# EAGLE design Rev B (EAGLE 6.5.0)

## Sheet 1 of 2
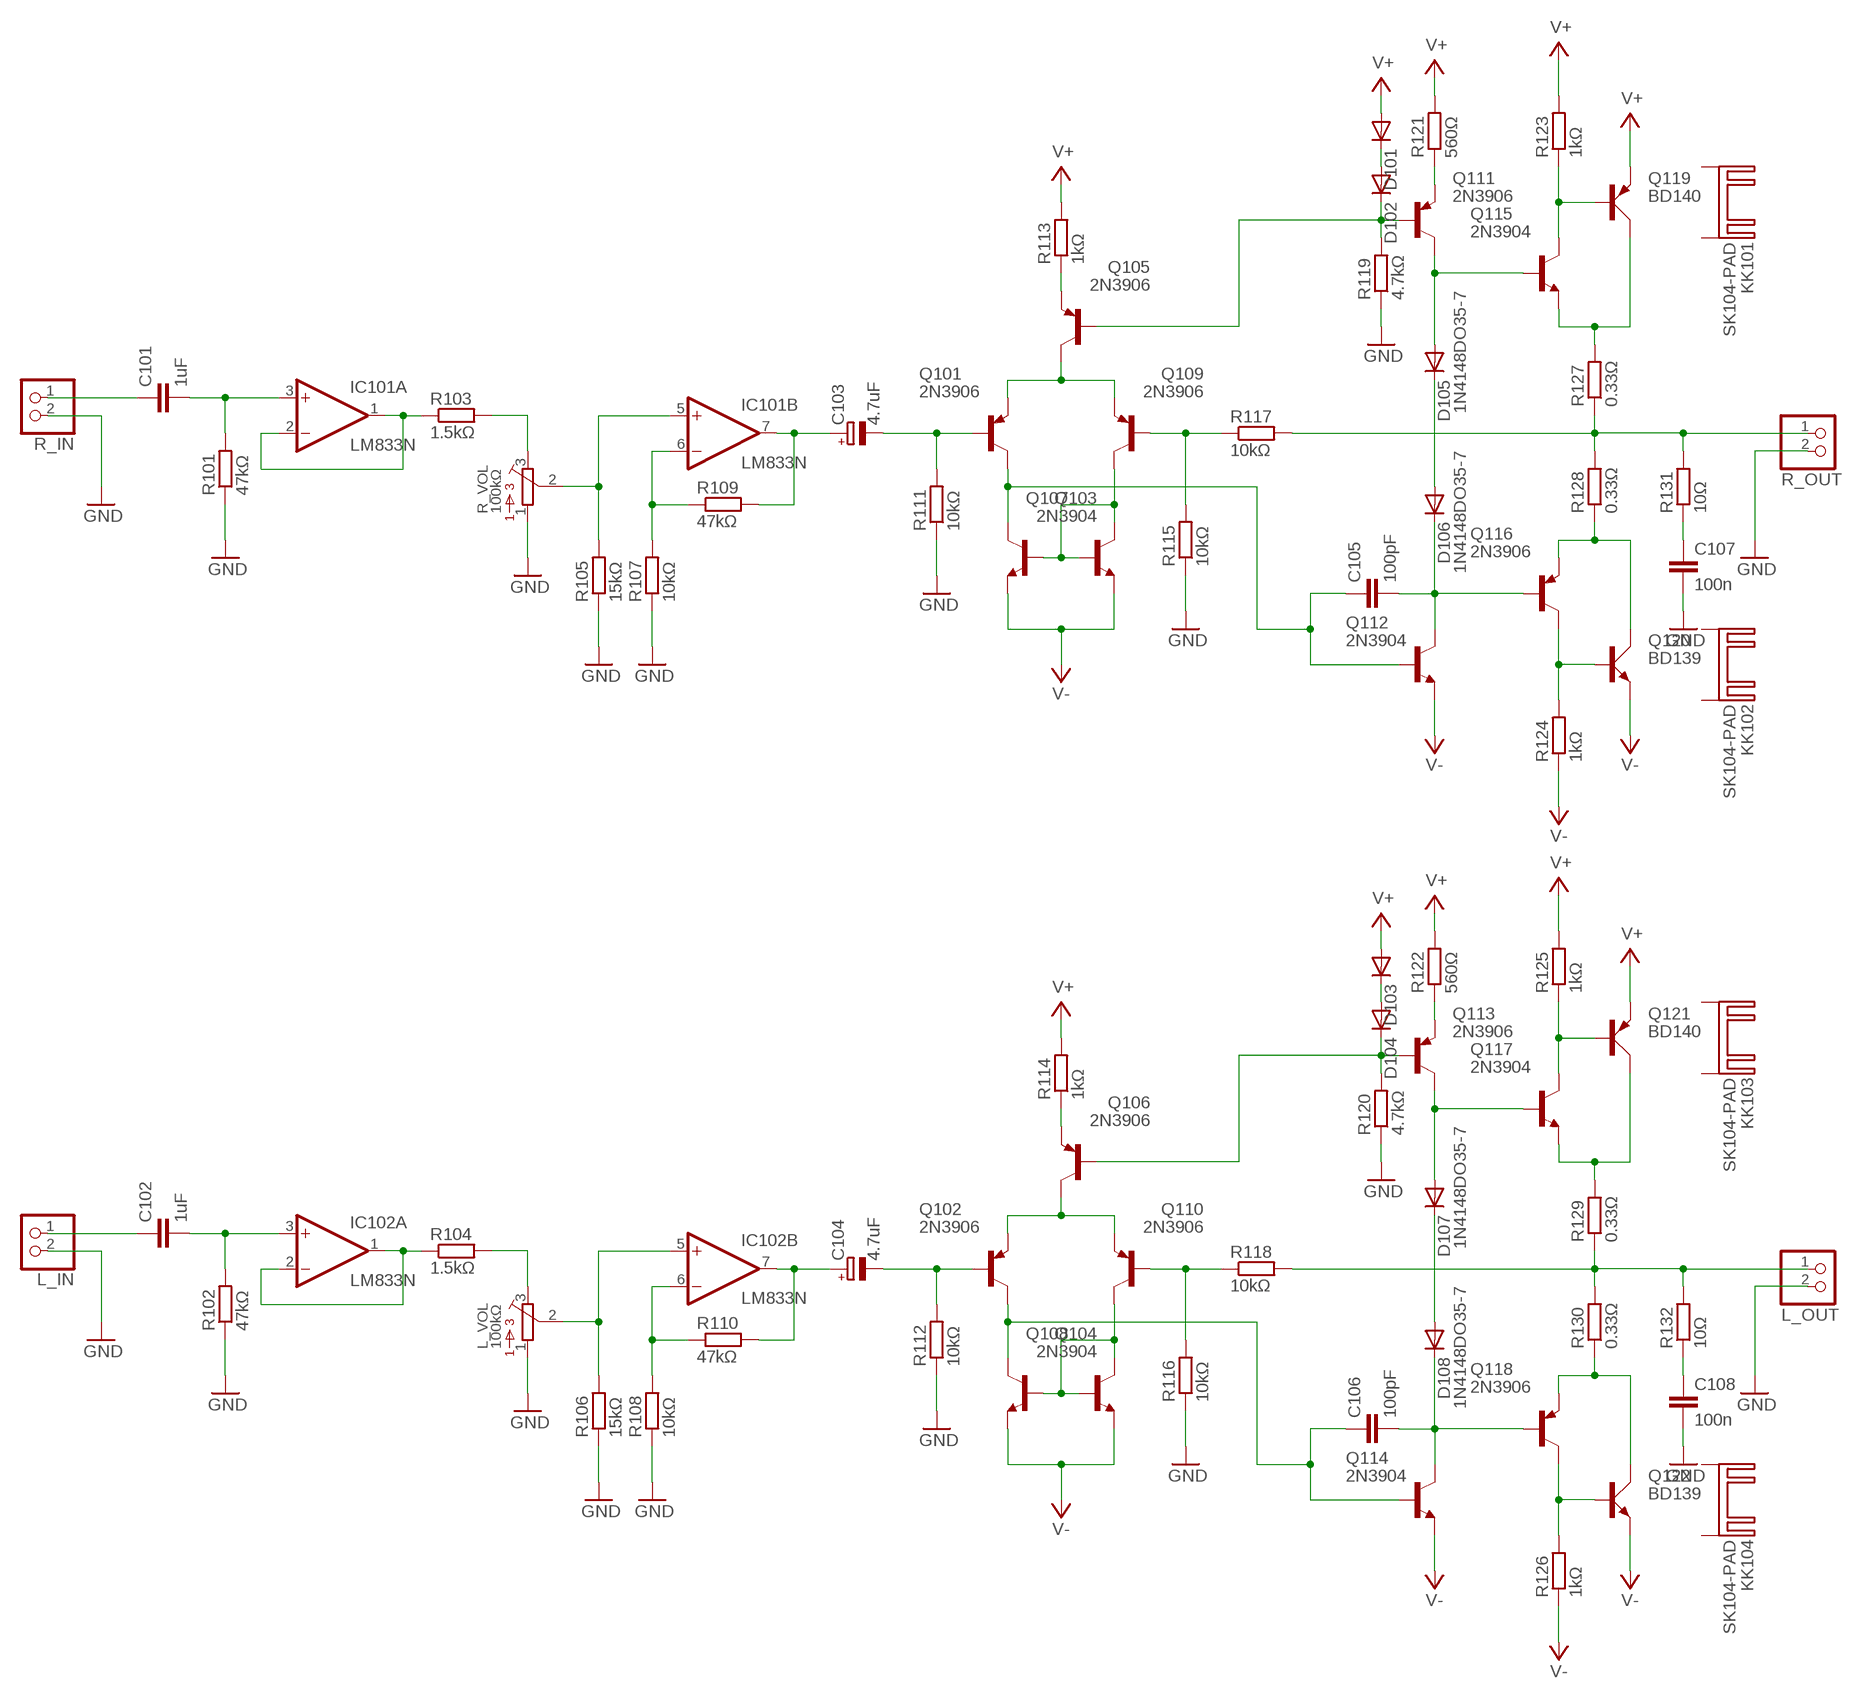
[diagram p0: schematic, sheet 1]

### Parts
C101  1uF  C-EU150-072X183  [C150-072X183]
C102  1uF  C-EU150-072X183  [C150-072X183]
C103  4.7uF  CPOL-EUE2-5  [E2-5]
C104  4.7uF  CPOL-EUE2-5  [E2-5]
C105  100pF  C-EU050-050X075  [C050-050X075]
C106  100pF  C-EU050-050X075  [C050-050X075]
C107  100n  C-EU075-042X103  [C075-042X103]
C108  100n  C-EU075-042X103  [C075-042X103]
D101  1N4148DO35-7  [DO35-7]
D102  1N4148DO35-7  [DO35-7]
D103  1N4148DO35-7  [DO35-7]
D104  1N4148DO35-7  [DO35-7]
D105  1N4148DO35-7  [DO35-7]
D106  1N4148DO35-7  [DO35-7]
D107  1N4148DO35-7  [DO35-7]
D108  1N4148DO35-7  [DO35-7]
IC101  LM833N  [DIL08]
IC102  LM833N  [DIL08]
KK101  SK104-PAD  [SK104-PAD]
KK102  SK104-PAD  [SK104-PAD]
KK103  SK104-PAD  [SK104-PAD]
KK104  SK104-PAD  [SK104-PAD]
L_IN  JST_2PIN-THM  [JST-PH-2-THM]
L_OUT  JST_2PIN-THM  [JST-PH-2-THM]
L_VOL  100kΩ  3362U  [3362U]
Q101  2N3906  [TO92]
Q102  2N3906  [TO92]
Q103  2N3904  [TO92]
Q104  2N3904  [TO92]
Q105  2N3906  [TO92]
Q106  2N3906  [TO92]
Q107  2N3904  [TO92]
Q108  2N3904  [TO92]
Q109  2N3906  [TO92]
Q110  2N3906  [TO92]
Q111  2N3906  [TO92]
Q112  2N3904  [TO92]
Q113  2N3906  [TO92]
Q114  2N3904  [TO92]
Q115  2N3904  [TO92]
Q116  2N3906  [TO92]
Q117  2N3904  [TO92]
Q118  2N3906  [TO92]
Q119  BD140  [TO126AV]
Q120  BD139  [TO126AV]
Q121  BD140  [TO126AV]
Q122  BD139  [TO126AV]
R101  47kΩ  R-EU_0207/10  [0207/10]
R102  47kΩ  R-EU_0207/10  [0207/10]
R103  1.5kΩ  R-EU_0207/10  [0207/10]
R104  1.5kΩ  R-EU_0207/10  [0207/10]
R105  15kΩ  R-EU_0207/10  [0207/10]
R106  15kΩ  R-EU_0207/10  [0207/10]
R107  10kΩ  R-EU_0207/10  [0207/10]
R108  10kΩ  R-EU_0207/10  [0207/10]
R109  47kΩ  R-EU_0207/10  [0207/10]
R110  47kΩ  R-EU_0207/10  [0207/10]
R111  10kΩ  R-EU_0207/10  [0207/10]
R112  10kΩ  R-EU_0207/10  [0207/10]
R113  1kΩ  R-EU_0207/10  [0207/10]
R114  1kΩ  R-EU_0207/10  [0207/10]
R115  10kΩ  R-EU_0207/10  [0207/10]
R116  10kΩ  R-EU_0207/10  [0207/10]
R117  10kΩ  R-EU_0207/10  [0207/10]
R118  10kΩ  R-EU_0207/10  [0207/10]
R119  4.7kΩ  R-EU_0207/10  [0207/10]
R120  4.7kΩ  R-EU_0207/10  [0207/10]
R121  560Ω  R-EU_0207/10  [0207/10]
R122  560Ω  R-EU_0207/10  [0207/10]
R123  1kΩ  R-EU_0207/10  [0207/10]
R124  1kΩ  R-EU_0207/10  [0207/10]
R125  1kΩ  R-EU_0207/10  [0207/10]
R126  1kΩ  R-EU_0207/10  [0207/10]
R127  0.33Ω  R-EU_0309/12  [0309/12]
R128  0.33Ω  R-EU_0309/12  [0309/12]
R129  0.33Ω  R-EU_0309/12  [0309/12]
R130  0.33Ω  R-EU_0309/12  [0309/12]
R131  10Ω  R-EU_0617/5V  [0617V]
R132  10Ω  R-EU_0617/5V  [0617V]
R_IN  JST_2PIN-THM  [JST-PH-2-THM]
R_OUT  JST_2PIN-THM  [JST-PH-2-THM]
R_VOL  100kΩ  3362U  [3362U]

### Nets
GND: C107.2 C108.2 L_IN.2 L_OUT.2 L_VOL.1 R101.1 R102.1 R105.1 R106.1 R107.1 R108.1 R111.1 R112.1 R115.1 R116.1 R119.1 R120.1 R_IN.2 R_OUT.2 R_VOL.1 ; also sheet 2
L_OUT: L_OUT.1 R118.2 R129.1 R130.2 R132.2
N$1: D105.A Q111.1(C) Q115.2(B)
N$2: Q101.3(E) Q105.1(C) Q109.3(E)
N$3: Q103.2(B) Q107.1(C) Q107.2(B) Q109.1(C)
N$4: Q104.2(B) Q108.1(C) Q108.2(B) Q110.1(C)
N$5: C103.- Q101.2(B) R111.2
N$6: C103.+ IC101.7(B:OUT) R109.2
N$7: C101.1 R_IN.1
N$8: C105.1 Q101.1(C) Q103.1(C) Q112.2(B)
N$9: C101.2 IC101.3(A:+IN) R101.2
N$11: IC102.1(A:OUT) IC102.2(A:-IN) R104.1
N$12: IC102.5(B:+IN) L_VOL.2 R106.2
N$13: L_VOL.3 R104.2
N$14: IC102.6(B:-IN) R108.2 R110.1
N$15: C102.1 L_IN.1
N$16: C102.2 IC102.3(A:+IN) R102.2
N$17: Q105.3(E) R113.1
N$18: Q111.3(E) R121.1
N$19: D102.C Q105.2(B) Q111.2(B) R119.2
N$20: D101.C D102.A
N$21: C107.1 R131.1
N$22: C108.1 R132.1
N$23: Q106.3(E) R114.1
N$24: D105.C D106.A
N$25: C104.- Q102.2(B) R112.2
N$26: Q115.1(C) Q119.B R123.1
N$27: Q116.1(C) Q120.B R124.2
N$28: Q116.3(E) Q120.C R128.1
N$29: Q115.3(E) Q119.C R127.2
N$30: C104.+ IC102.7(B:OUT) R110.2
N$31: C105.2 D106.C Q112.1(C) Q116.2(B)
N$32: Q109.2(B) R115.2 R117.1
N$33: Q102.3(E) Q106.1(C) Q110.3(E)
N$34: C106.1 Q102.1(C) Q104.1(C) Q114.2(B)
N$35: D107.C D108.A
N$36: D107.A Q113.1(C) Q117.2(B)
N$37: Q117.1(C) Q121.B R125.1
N$38: Q117.3(E) Q121.C R129.2
N$39: Q118.1(C) Q122.B R126.2
N$40: Q118.3(E) Q122.C R130.1
N$41: C106.2 D108.C Q114.1(C) Q118.2(B)
N$42: Q110.2(B) R116.2 R118.1
N$43: Q113.3(E) R122.1
N$44: D104.C Q106.2(B) Q113.2(B) R120.2
N$45: D103.C D104.A
N$56: IC101.1(A:OUT) IC101.2(A:-IN) R103.1
N$58: IC101.5(B:+IN) R105.2 R_VOL.2
N$60: R103.2 R_VOL.3
N$62: IC101.6(B:-IN) R107.2 R109.1
R_OUT: R117.2 R127.1 R128.2 R131.2 R_OUT.1
V+: D101.A D103.A Q119.E Q121.E R113.2 R114.2 R121.2 R122.2 R123.2 R125.2 ; also sheet 2
V-: Q103.3(E) Q104.3(E) Q107.3(E) Q108.3(E) Q112.3(E) Q114.3(E) Q120.E Q122.E R124.1 R126.1 ; also sheet 2
Unconnected: KK101.K1(K) KK101.K2(K) KK102.K1(K) KK102.K2(K) KK103.K1(K) KK103.K2(K) KK104.K1(K) KK104.K2(K)

## Sheet 2 of 2
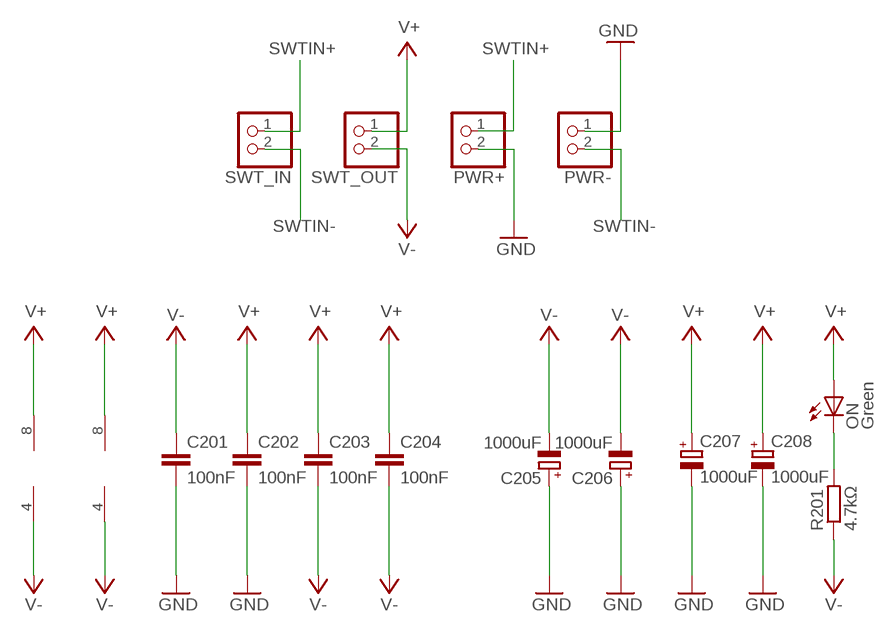
[diagram p1: schematic, sheet 2]

### Parts
C201  100nF  C-EU025-025X050  [C025-025X050]
C202  100nF  C-EU025-025X050  [C025-025X050]
C203  100nF  C-EU025-025X050  [C025-025X050]
C204  100nF  C-EU025-025X050  [C025-025X050]
C205  1000uF  CPOL-EUE5-10.5  [E5-10,5]
C206  1000uF  CPOL-EUE5-10.5  [E5-10,5]
C207  1000uF  CPOL-EUE5-10.5  [E5-10,5]
C208  1000uF  CPOL-EUE5-10.5  [E5-10,5]
ON  Green  LED5MM  [LED5MM]
PWR+  JST_2PIN-THM  [JST-PH-2-THM]
PWR-  JST_2PIN-THM  [JST-PH-2-THM]
R201  4.7kΩ  R-EU_0207/10  [0207/10]
SWT_IN  JST_2PIN-THM  [JST-PH-2-THM]
SWT_OUT  JST_2PIN-THM  [JST-PH-2-THM]

### Nets
GND: C201.2 C202.2 C205.+ C206.+ C207.- C208.- PWR+.2 PWR-.1 ; also sheet 1
N$10: ON.K(C) R201.2
SWTIN+: PWR+.1 SWT_IN.1
SWTIN-: PWR-.2 SWT_IN.2
V+: C202.1 C203.1 C204.1 C207.+ C208.+ IC101.8(P:V+) IC102.8(P:V+) ON.A SWT_OUT.1 ; also sheet 1
V-: C201.1 C203.2 C204.2 C205.- C206.- IC101.4(P:V-) IC102.4(P:V-) R201.1 SWT_OUT.2 ; also sheet 1

## Library data of the parts
C101 C102 C105-C108 C201-C204 = rcl:C-EU: CAPACITOR, European symbol
C103 C104 C205-C208 = rcl:CPOL-EU: POLARIZED CAPACITOR, European symbol
D101-D108 = diode:1N4148: DIODE high speed (Philips)
IC101 IC102 = linear:LM833: OP AMP
KK101-KK104 = heatsink:SK104-PAD: HEATSINK manufacturer Fischer/distributor Buerklin
L_IN L_OUT PWR+ PWR- R_IN R_OUT SWT_IN SWT_OUT = adafruit:JST_2PIN: JST 2-Pin Connectors of various flavors SMT-RA (S2B-PH-SM4) 4UConnector #17311 SMT (B2B-PH-SM4) THM-RA (S2B-PH) THM (B2B-PH)
L_VOL R_VOL = bourns:3362: 3362 Series 1/4" Square Trimmer
ON = led:LED: LED OSRAM: - CHIPLED LG R971, LG N971, LY N971, LG Q971, LY Q971, LO R971, LY R971 LH N974, LH R974 LS Q976, LO Q976, LY Q976 LO Q996 - Hyper CHIPLED LW Q18S LB Q993, LB Q99A, LB R99A - SideLED LS A670, LO A670, LY A670, LG A670, LP A670 LB A673, LV A673, LT A673, LW A673 LH A674 LY A675 LS A676, LA A676, LO A676, LY A676, LW A676 LS A679, LY A679, LG A679 - Hyper Micro SIDELED® LS Y876, LA Y876, LO Y876, LY Y876 LT Y87S - SmartLED LW L88C, LW L88S LB L89C, LB L89S, LG L890 LS L89K, LO L89K, LY L89K LS L896, LA L896, LO L896, LY L896 - TOPLED LS T670, LO T670, LY T670, LG T670, LP T670 LSG T670, LSP T670, LSY T670, LOP T670, LYG T670 LG T671, LOG T671, LSG T671 LB T673, LV T673, LT T673, LW T673 LH T674 LS T676, LA T676, LO T676, LY T676, LB T676, LH T676, LSB T676, LW T676 LB T67C, LV T67C, LT T67C, LS T67K, LO T67K, LY T67K, LW E67C LS E67B, LA E67B, LO E67B, LY E67B, LB E67C, LV E67C, LT E67C LW T67C LS T679, LY T679, LG T679 LS T770, LO T770, LY T770, LG T770, LP T770 LB T773, LV T773, LT T773, LW T773 LH T774 LS E675, LA E675, LY E675, LS T675 LS T776, LA T776, LO T776, LY T776, LB T776 LHGB T686 LT T68C, LB T68C - Hyper Mini TOPLED® LB M676 - Mini TOPLED Santana® LG M470 LS M47K, LO M47K, LY M47K Source: http://www.osram.convergy.de LUXEON: - LUMILED® LXK2-PW12-R00, LXK2-PW12-S00, LXK2-PW14-U00, LXK2-PW14-V00 LXK2-PM12-R00, LXK2-PM12-S00, LXK2-PM14-U00 LXK2-PE12-Q00, LXK2-PE12-R00, LXK2-PE12-S00, LXK2-PE14-T00, LXK2-PE14-U00 LXK2-PB12-K00, LXK2-PB12-L00, LXK2-PB12-M00, LXK2-PB14-N00, LXK2-PB14-P00, LXK2-PB14-Q00 LXK2-PR12-L00, LXK2-PR12-M00, LXK2-PR14-Q00, LXK2-PR14-R00 LXK2-PD12-Q00, LXK2-PD12-R00, LXK2-PD12-S00 LXK2-PH12-R00, LXK2-PH12-S00 LXK2-PL12-P00, LXK2-PL12-Q00, LXK2-PL12-R00 Source: www.luxeon.com KINGBRIGHT: KA-3528ASYC Source: www.kingbright.com
Q101 Q102 Q105 Q106 Q109-Q111 Q113 Q116 Q118 = transistor-pnp:2N3906: PNP Transistor
Q103 Q104 Q107 Q108 Q112 Q114 Q115 Q117 = transistor:2N3904: NPN TRANSISTOR
Q119 Q121 = transistor-power:BD140: PNP TRANSISTOR
Q120 Q122 = transistor-power:BD139: NPN TRANSISTOR
R101-R132 R201 = rcl:R-EU_: RESISTOR, European symbol

## Board
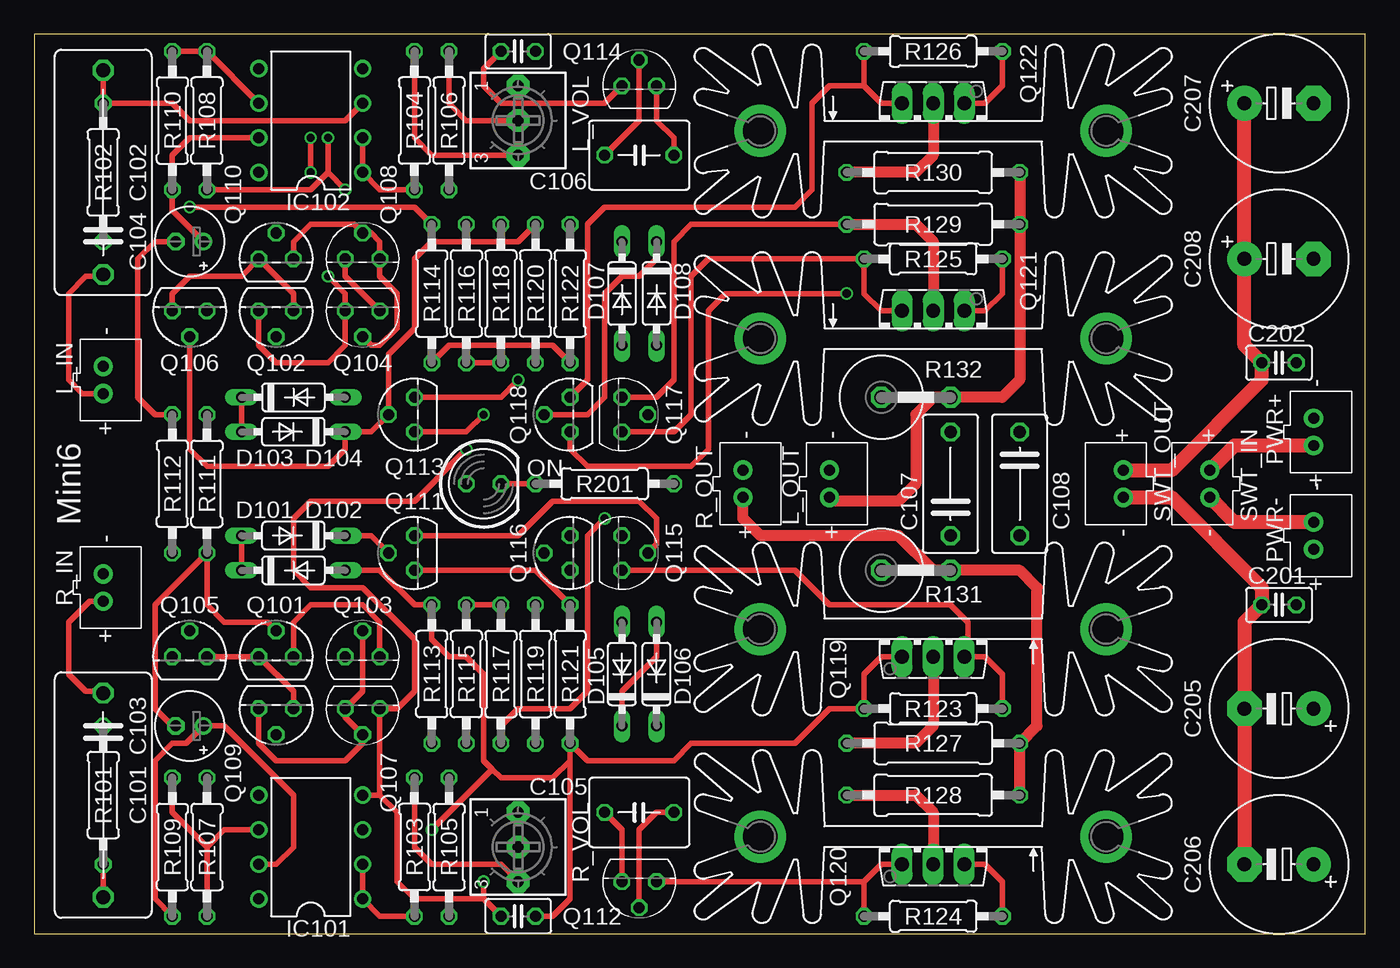
[diagram p2: board, top side]
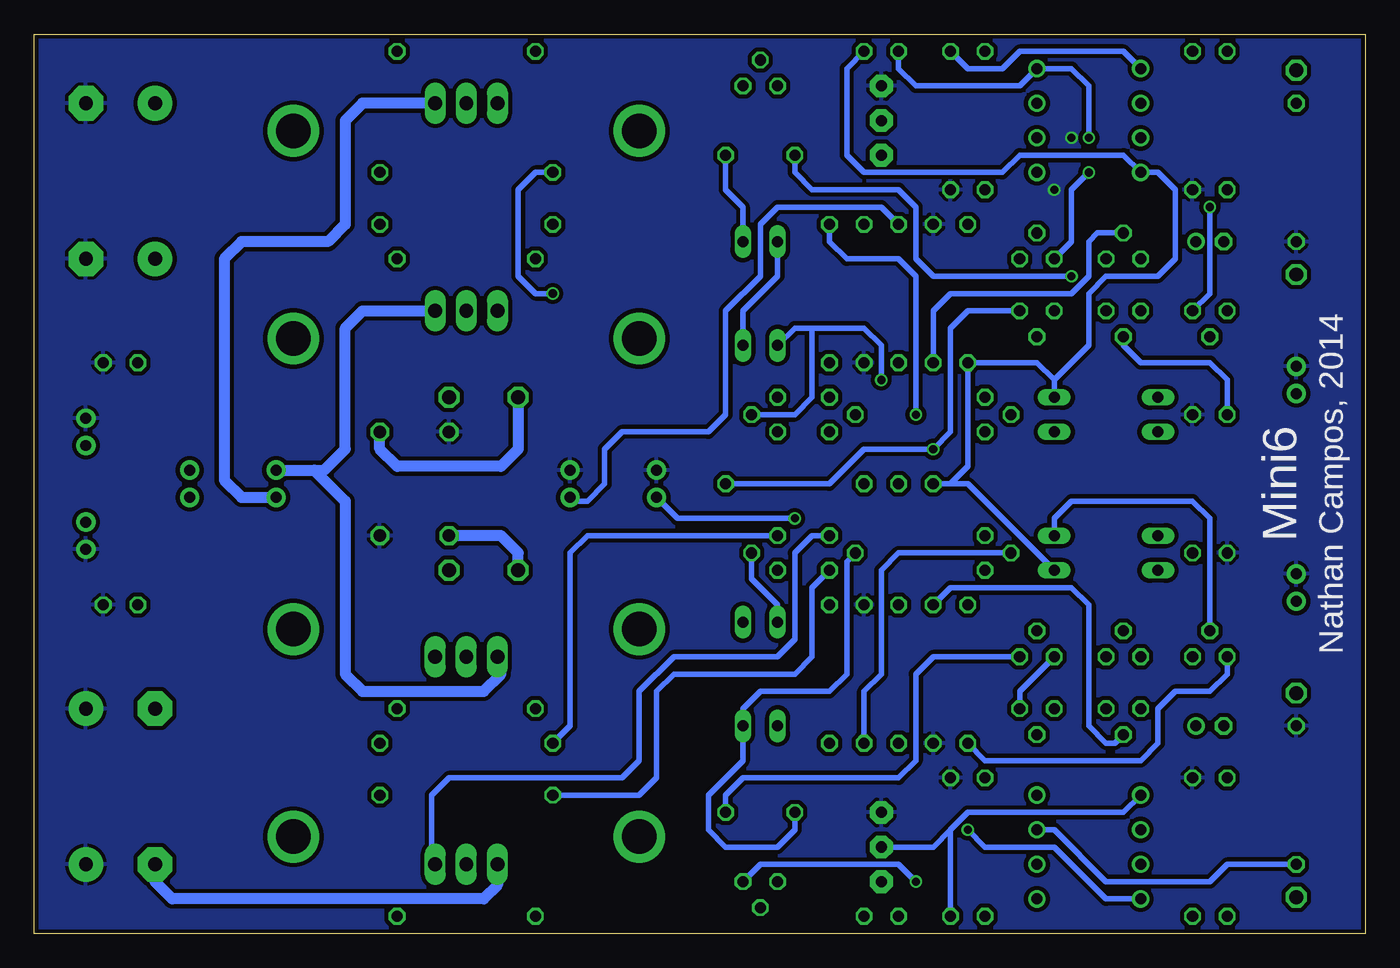
[diagram p3: board, bottom side, seen from below]

Size 97.79 x 66.04 mm. Coordinates in mm from the lower left corner, seen from the top.
Outline: 0,0 97.77,0 97.79,66.04 0,66.04 0,0
Copper layers (1*2*15*16): Top 0.035mm / dielectric 0.2mm / Route2 0.0175mm / dielectric 1.1mm / Route15 0.0175mm / dielectric 0.2mm / Bottom 0.035mm
Design rules "SeeedStudio_DRU_no_angle_20130527": minimum track width 6mil, minimum drill 12mil, track to track 6mil, track to pad 6mil, pad to pad 6mil, via to via 6mil, smd to smd 0mil, copper to edge 10mil, drill to drill 10mil, minimum pad ring 6mil, minimum via ring 6mil, stop-mask expansion 2mil, vias tented up to drill 25mil, thermal gap 10mil

### Footprints (pad centres in the part's own frame; a part is rotated, then mirrored left to right if it is on the bottom)
C150-072X183 = drill 1.016 octagon: 1 -7.493,0; 2 7.493,0
E2-5 = drill 0.813 pad 1.27: + -1.016,0 | drill 0.813 pad 1.27 octagon: - 1.016,0
C050-050X075 = drill 0.813 octagon: 1 -2.54,0; 2 2.54,0
C075-042X103 = drill 0.914 octagon: 1 -3.81,0; 2 3.81,0
C025-025X050 = drill 0.813 octagon: 1 -1.27,0; 2 1.27,0
E5-10,5 = drill 1.016 pad 2.54: + -2.54,0 | drill 1.016 pad 2.54 octagon: - 2.54,0
DO35-7 = drill 0.813 long: A 3.81,0; C -3.81,0
DIL08 = drill 0.813 pad 1.27: 1 -3.81,-3.81; 2 -1.27,-3.81; 3 1.27,-3.81; 4 3.81,-3.81; 5 3.81,3.81; 6 1.27,3.81; 7 -1.27,3.81; 8 -3.81,3.81
SK104-PAD = drill 2.54 pad 3.81: K1 -12.7,-0.762; K2 12.7,-0.762
JST-PH-2-THM = drill 0.8 pad 1.422: 1 1,0; 2 -1,0
3362U = drill 0.813 pad 1.676 octagon: 1 -2.54,0; 2 0,0; 3 2.54,0
LED5MM = drill 0.813 octagon: A -1.27,0; K 1.27,0
TO92 = drill 0.813 octagon: 1 1.27,0; 2 0,1.905; 3 -1.27,0
TO126AV = drill 1.016 long: B 2.286,-1.27; C 0,-1.27; E -2.286,-1.27
0207/10 = drill 0.813 octagon: 1 -5.08,0; 2 5.08,0
0309/12 = drill 0.813 octagon: 1 -6.35,0; 2 6.35,0
0617V = drill 1.016 octagon: 1 -2.54,0; 2 2.54,0

### Placement (x,y rotation side)
C101  5.08,10.16 270 top
C102  5.08,55.88 90 top
C103  11.43,15.24 180 top
C104  11.43,50.8 180 top
C105  44.45,8.89 180 top
C106  44.45,57.15 0 top
C107  67.31,33.02 90 top
C108  72.39,33.02 270 top
C201  91.44,24.13 0 top
C202  91.44,41.91 0 top
C203  35.56,1.27 180 top
C204  35.56,64.77 180 top
C205  91.44,16.51 180 top
C206  91.44,5.08 180 top
C207  91.44,60.96 0 top
C208  91.44,49.53 0 top
D101  19.05,26.67 0 top
D102  19.05,29.21 180 top
D103  19.05,39.37 0 top
D104  19.05,36.83 180 top
D105  43.18,19.05 90 top
D106  45.72,19.05 90 top
D107  43.18,46.99 270 top
D108  45.72,46.99 270 top
IC101  20.32,6.35 90 top
IC102  20.32,59.69 90 top
KK101  66.04,21.59 180 top
KK102  66.04,44.45 0 top
KK103  66.04,6.35 180 top
KK104  66.04,59.69 0 top
L_IN  5.08,40.64 270 top
L_OUT  58.42,33.02 270 top
L_VOL  35.56,59.69 270 top
ON  33.02,33.02 0 top
PWR+  93.98,36.83 270 top
PWR-  93.98,29.21 270 top
Q101  17.78,20.32 0 top
Q102  17.78,45.72 180 top
Q103  24.13,20.32 0 top
Q104  24.13,45.72 180 top
Q105  11.43,20.32 0 top
Q106  11.43,45.72 180 top
Q107  24.13,16.51 180 top
Q108  24.13,49.53 0 top
Q109  17.78,16.51 180 top
Q110  17.78,49.53 0 top
Q111  27.94,27.94 90 top
Q112  44.45,3.81 180 top
Q113  27.94,38.1 90 top
Q114  44.45,62.23 0 top
Q115  43.18,27.94 270 top
Q116  39.37,27.94 90 top
Q117  43.18,38.1 270 top
Q118  39.37,38.1 90 top
Q119  66.04,21.59 0 top
Q120  66.04,6.35 0 top
Q121  66.04,44.45 180 top
Q122  66.04,59.69 180 top
R101  5.08,10.16 270 top
R102  5.08,55.88 90 top
R103  27.94,6.35 90 top
R104  27.94,59.69 90 top
R105  30.48,6.35 270 top
R106  30.48,59.69 90 top
R107  12.7,6.35 270 top
R108  12.7,59.69 90 top
R109  10.16,6.35 270 top
R110  10.16,59.69 270 top
R111  12.7,33.02 270 top
R112  10.16,33.02 90 top
R113  29.21,19.05 90 top
R114  29.21,46.99 270 top
R115  31.75,19.05 90 top
R116  31.75,46.99 270 top
R117  34.29,19.05 270 top
R118  34.29,46.99 90 top
R119  36.83,19.05 270 top
R120  36.83,46.99 90 top
R121  39.37,19.05 270 top
R122  39.37,46.99 270 top
R123  66.04,16.51 180 top
R124  66.04,1.27 0 top
R125  66.04,49.53 0 top
R126  66.04,64.77 180 top
R127  66.04,13.97 180 top
R128  66.04,10.16 0 top
R129  66.04,52.07 180 top
R130  66.04,55.88 0 top
R131  64.77,26.67 0 top
R132  64.77,39.37 0 top
R201  41.91,33.02 180 top
R_IN  5.08,25.4 270 top
R_OUT  52.07,33.02 270 top
R_VOL  35.56,6.35 270 top
SWT_IN  86.36,33.02 90 top
SWT_OUT  80.01,33.02 90 top

### Tracks (layer width: path | path; a pad name or v marks a point on that pad's centre or on a via)
GND  (via drill 0.6)
  Top 0.406: 21.59,55.88 v22.86,54.61 | R108.1 20.32,54.61 21.59,55.88 | v21.59,58.42 21.59,55.88
  pour Bottom (isolate 0.305): 0,66.04 0,0 97.79,0 97.79,66.04
L_OUT
  Top 0.813: R130.2 R129.1 72.39,40.64 71.12,39.37 R132.2 66.04,39.37 64.77,38.1 64.77,33.02 63.5,31.75 58.69,31.75 L_OUT.1
  Bottom 0.406: R118.2 35.56,53.34 43.18,53.34 44.45,52.07 44.45,48.26 46.99,45.72 46.99,38.1 48.26,36.83 54.61,36.83 55.88,35.56 55.88,33.02 57.15,31.75 58.15,31.75 L_OUT.1
N$1
  Top 0.406: Q111.1 35.56,29.21 38.1,31.75 44.45,31.75 45.72,30.48 45.72,28.57 Q115.2
  Bottom 0.406: Q115.2 45.09,26.04 43.18,24.13 D105.A
N$2
  Top 0.406: Q105.1 Q101.3 19.05,17.78 Q109.3
N$3
  Top 0.406: Q103.2 24.13,17.78 Q107.1 22.86,15.88 Q107.2 24.13,13.97 22.86,12.7 17.78,12.7 16.51,13.97 Q109.1
N$4
  Top 0.406: Q104.2 24.77,43.18 25.4,43.18 26.67,44.45 26.67,46.99 25.4,48.26 Q108.1 25.4,50.8 24.77,51.44 Q108.2 23.5,52.07 20.32,52.07 19.05,50.8 Q110.1
N$5
  Top 0.406: C103.- 10.16,15.24 8.89,16.51 8.89,24.13 R111.2 12.7,24.13 13.97,22.86 17.14,22.86 Q101.2
N$6
  Top 0.406: R109.2 8.89,2.54 8.89,12.7 10.16,13.97 11.18,13.97 C103.+ 13.97,15.24 19.05,10.16 19.05,6.35 17.78,5.08 IC101.7
N$7
  Top 0.406: R_IN.1 4.08,24.4 2.54,22.86 2.54,19.05 3.81,17.78 4.95,17.78 C101.1
N$8
  Top 0.406: Q112.2 44.45,7.62 45.72,8.89 C105.1 | Q103.1 25.4,22.86 24.13,24.13 20.32,24.13 19.05,22.86 Q101.1
  Bottom 0.406: Q103.1 31.75,20.32 33.02,19.05 33.02,12.7 34.29,11.43 45.72,11.43 46.99,10.16 C105.1
N$9
  Top 0.406: R101.2 C101.2
  Bottom 0.406: R101.2 10.16,5.08 11.43,3.81 19.05,3.81 22.86,7.62 IC101.3
N$10
  Top 0.406: ON.K R201.2
N$11
  Top 0.406: R104.1 25.4,54.61 IC102.1 IC102.2
N$12
  Top 0.406: R106.2 30.48,60.96 31.75,59.69 L_VOL.2
  Bottom 0.406: IC102.5 17.78,64.77 25.4,64.77 26.67,63.5 29.21,63.5 R106.2
N$13
  Top 0.406: R104.2 27.94,58.42 29.21,57.15 L_VOL.3
N$14
  Top 0.406: R110.1 R108.2 IC102.6
N$15
  Top 0.406: L_IN.1 3.54,39.64 2.54,40.64 2.54,46.99 3.81,48.26 4.95,48.26 C102.1
N$16
  Top 0.406: C102.2 R102.2 10.16,60.96 11.43,59.69 22.86,59.69 IC102.3
N$17
  Bottom 0.406: Q105.3 10.16,19.05 11.43,17.78 13.97,17.78 15.24,16.51 15.24,13.97 16.51,12.7 27.94,12.7 R113.1
N$18
  Top 0.406: Q111.3 36.83,26.67 R121.1
N$19
  Top 0.406: D102.C 24.77,29.21 Q111.2
  Bottom 0.406: R119.2 36.83,17.78 35.56,19.05 35.56,26.67 34.29,27.94 Q111.2 | Q105.2 11.43,30.48 12.7,31.75 21.59,31.75 22.86,30.48 D102.C
N$20
  Top 0.406: D102.A D101.C
N$21
  Bottom 0.813: R131.1 62.23,27.94 63.5,29.21 C107.1
N$22
  Bottom 0.813: R132.1 62.23,35.56 63.5,34.29 71.12,34.29 72.39,35.56 C108.1
N$23  (via drill 0.6)
  Top 0.406: R114.1 27.94,53.34 v11.43,53.34
  Bottom 0.406: v11.43,53.34 11.43,46.99 Q106.3
N$24
  Top 0.406: D106.A 45.72,20.32 43.18,17.78 D105.C
N$25
  Top 0.406: C104.- 8.89,50.8 7.62,49.53 7.62,39.37 8.89,38.1 R112.2
  Bottom 0.406: R112.2 10.16,40.64 11.43,41.91 16.51,41.91 17.78,43.18 Q102.2
N$26
  Top 0.406: R123.1 71.12,19.05 69.85,20.32 Q119.B 68.58,20.57 68.58,22.86 67.31,24.13 58.42,24.13 55.88,26.67 Q115.1
N$27
  Top 0.406: Q120.B 69.85,5.08 71.12,3.81 R124.2
  Bottom 0.406: Q116.1 40.64,29.21 41.91,27.94 41.91,21.59 43.18,20.32 50.8,20.32 53.34,17.78 53.34,12.7 54.61,11.43 67.31,11.43 68.58,10.16 68.58,5.33 Q120.B
N$28
  Top 0.813: R128.1 64.77,10.16 66.04,8.89 Q120.C
  Bottom 0.406: Q116.3 40.64,25.4 40.64,20.32 41.91,19.05 50.8,19.05 52.07,17.78 52.07,11.43 53.34,10.16 R128.1
N$29
  Top 0.813: Q119.C 66.04,15.24 64.77,13.97 R127.2
  Bottom 0.406: Q115.3 57.15,29.21 58.42,27.94 58.42,15.24 R127.2
N$30
  Top 0.406: IC102.7 11.43,58.42 10.16,57.15 R110.2 10.16,53.09 C104.+
N$31
  Top 0.406: C105.2 43.18,7.62 Q112.1
  Bottom 0.406: C105.2 41.91,7.62 43.18,6.35 46.99,6.35 48.26,7.62 48.26,10.16 45.72,12.7 D106.C 45.72,16.51 44.45,17.78 39.37,17.78 38.1,19.05 38.1,27.3 Q116.2
N$32
  Top 0.406: R117.1 R115.2
  Bottom 0.406: R115.2 30.48,25.4 21.59,25.4 20.32,24.13 20.32,15.24 19.05,13.97 18.41,13.97 Q109.2
N$33
  Top 0.406: Q106.1 10.16,46.99 11.43,48.26 15.24,48.26 Q110.3 19.05,46.99 Q102.3
N$34  (via drill 0.6)
  Top 0.406: Q114.2 44.45,59.69 C106.1 | Q102.1 16.51,43.18 17.78,41.91 21.59,41.91 22.86,43.18 Q104.1 22.86,46.99 v21.59,48.26
  Bottom 0.406: v21.59,48.26 31.75,48.26 33.02,49.53 33.02,53.34 34.29,54.61 40.64,54.61 41.91,55.88 C106.1
N$35
  Bottom 0.406: D107.C 43.18,48.26 45.72,45.72 D108.A
N$36  (via drill 0.6)
  Top 0.406: Q113.1 34.29,39.37 v35.56,40.64
  Bottom 0.406: v35.56,40.64 35.56,43.18 36.83,44.45 40.64,44.45 | 40.64,44.45 41.91,44.45 D107.A | Q117.2 41.91,38.1 40.64,39.37 40.64,44.45
N$37
  Top 0.406: Q121.B 62.23,45.72 60.96,46.99 R125.1 49.53,49.53 48.26,48.26 48.26,38.1 46.99,36.83 Q117.1
N$38
  Top 0.406: Q117.3 45.72,39.37 46.99,40.64 46.99,50.8 48.26,52.07 R129.2
  Top 0.813: R129.2 64.77,52.07 66.04,50.8 Q121.C
N$39
  Top 0.406: R126.2 60.96,62.23 | 60.96,62.23 62.23,60.96 Q122.B | Q118.1 40.64,40.64 40.64,52.07 41.91,53.34 55.88,53.34 57.15,54.61 57.15,60.96 58.42,62.23 60.96,62.23
N$40  (via drill 0.6)
  Top 0.406: Q118.3 39.37,35.56 40.64,34.29 48.26,34.29 49.53,35.56 49.53,45.72 50.8,46.99 v59.69,46.99
  Top 0.813: Q122.C 66.04,57.15 64.77,55.88 R130.1
  Bottom 0.406: R130.1 60.96,55.88 62.23,54.61 62.23,48.26 60.96,46.99 v59.69,46.99
N$41
  Top 0.406: C106.2 46.99,58.42 45.72,59.69 Q114.1 | Q118.2 40.64,38.1 41.91,39.37 41.91,46.99 43.18,48.26 44.45,48.26 45.72,49.53 D108.C
  Bottom 0.406: C106.2 46.99,54.61 45.72,53.34 D108.C
N$42
  Top 0.406: R118.1 R116.2
  Bottom 0.406: Q110.2 19.68,51.44 20.32,50.8 20.32,48.26 21.59,46.99 30.48,46.99 31.75,45.72 R116.2
N$43  (via drill 0.6)
  Top 0.406: Q113.3 31.75,36.83 v33.02,38.1
  Bottom 0.406: v33.02,38.1 33.02,48.26 34.29,49.53 38.1,49.53 39.37,50.8 R122.1
N$44
  Top 0.406: Q106.2 11.43,35.56 12.7,34.29 21.59,34.29 22.86,35.56 D104.C 24.77,36.83 Q113.2 26.04,42.55 27.94,44.45 27.94,49.53 29.21,50.8 35.56,50.8 R120.2
N$45
  Top 0.406: D103.C D104.A
N$56
  Top 0.406: IC101.2 IC101.1 25.4,1.27 R103.1
N$58
  Bottom 0.406: R105.2 30.48,7.62 | 30.48,7.62 29.21,8.89 17.78,8.89 IC101.5 | R_VOL.2 31.75,6.35 30.48,7.62
N$60
  Top 0.406: R103.2 27.94,6.35 29.21,5.08 34.29,5.08 R_VOL.3
N$62
  Top 0.406: R107.2 12.7,6.35 | 12.7,6.35 13.97,7.62 IC101.6 | R109.1 10.16,8.89 12.7,6.35
R_OUT  (via drill 0.6)
  Top 0.406: R117.2 34.29,15.24 35.56,16.51 39.37,16.51 40.64,17.78 40.64,29.21 v41.91,30.48
  Top 0.813: R_OUT.1 52.07,30.48 53.34,29.21 63.5,29.21 66.04,26.67 R131.2 72.39,26.67 73.66,25.4 73.66,15.24 R127.1 R128.2
  Bottom 0.406: v41.91,30.48 50.53,30.48 R_OUT.1
SWTIN+
  Top 1.016: PWR+.1 88.17,35.83 SWT_IN.1
SWTIN-
  Top 1.016: PWR-.2 88.17,30.21 SWT_IN.2
V+  (via drill 0.6)
  Top 0.406: Q119.E 62.23,20.32 60.96,19.05 R123.2 58.42,16.51 55.88,13.97 48.26,13.97 46.99,12.7 40.64,12.7 R121.2 39.37,12.7 | R125.2 71.12,46.99 69.85,45.72 Q121.E | C203.1 38.1,1.27 39.37,2.54 39.37,12.7 | D101.A 25.4,26.67 27.94,24.13 R113.2 29.21,21.59 30.48,20.32 31.75,20.32 33.02,19.05 33.02,12.7 33.66,12.06 | 33.66,12.06 34.29,11.43 38.1,11.43 39.37,12.7 | v29.21,7.62 33.66,12.06 | R114.2 30.48,43.18 38.1,43.18 R122.2
  Top 1.016: SWT_OUT.1 83.55,34.02 90.17,40.64 C202.1 88.9,43.18 C208.+ C207.+
  Bottom 0.406: ON.A 30.48,33.02 | 30.48,33.02 29.21,33.02 D101.A | D103.A 22.86,40.64 | 22.86,40.64 20.32,43.18 20.32,46.99 19.05,48.26 15.24,48.26 13.97,49.53 13.97,54.61 15.24,55.88 IC102.8 17.78,57.15 25.4,57.15 26.67,55.88 36.83,55.88 38.1,57.15 38.1,63.5 C204.1 | 22.86,40.64 24.13,41.91 R114.2 29.21,34.29 30.48,33.02 | IC101.8 19.05,2.54 22.86,6.35 27.94,6.35 v29.21,7.62
  Bottom 0.813: Q119.E 63.5,20.07 63.5,19.05 64.77,17.78 73.66,17.78 74.93,19.05 74.93,31.75 77.2,34.02 SWT_OUT.1 76.47,34.02 74.93,35.56 74.93,44.45 73.66,45.72 Q121.E
V-  (via drill 0.6)
  Top 0.406: R124.1 60.96,3.81 | 60.96,3.81 62.23,5.08 Q120.E | R126.1 71.12,62.23 69.85,60.96 Q122.E | IC101.4 25.4,10.16 | 25.4,10.16 26.67,8.89 26.67,3.81 27.94,2.54 33.02,2.54 | 33.02,2.54 C203.2 | Q112.3 60.96,3.81 | 33.02,2.54 v33.02,3.81 | 25.4,10.16 Q107.3 26.67,16.51 27.94,17.78 27.94,21.59 24.13,25.4 20.32,25.4 19.05,26.67 19.05,30.48 20.32,31.75 27.94,31.75 v31.75,35.56 | C204.2 33.02,63.5 33.02,62.23 34.29,60.96 41.91,60.96 Q114.3 | Q104.3 22.86,48.26 Q108.3 | v20.32,55.88 v20.32,58.42
  Top 1.016: SWT_OUT.2 83.55,32.02 90.17,25.4 C201.1 88.9,22.86 C205.- C206.-
  Bottom 0.406: Q112.3 44.45,5.08 34.29,5.08 v33.02,3.81 | Q103.3 25.4,17.78 Q107.3 | C204.2 34.29,63.5 33.02,62.23 25.4,62.23 IC102.4 21.59,63.5 20.32,62.23 v20.32,58.42 | Q108.3 21.59,50.8 21.59,54.61 v20.32,55.88 | Q104.3 29.21,45.72 30.48,44.45 30.48,36.83 v31.75,35.56 36.83,35.56 39.37,33.02 R201.1
  Bottom 0.813: Q120.E 63.75,3.56 64.77,2.54 87.63,2.54 88.9,3.81 C206.- | Q122.E 73.66,60.96 74.93,59.69 74.93,52.07 76.2,50.8 82.55,50.8 83.82,49.53 83.82,33.29 82.55,32.02 SWT_OUT.2

### Text on the board
tPlace: Mini6
bPlace: Nathan Campos, 2014 | Mini6